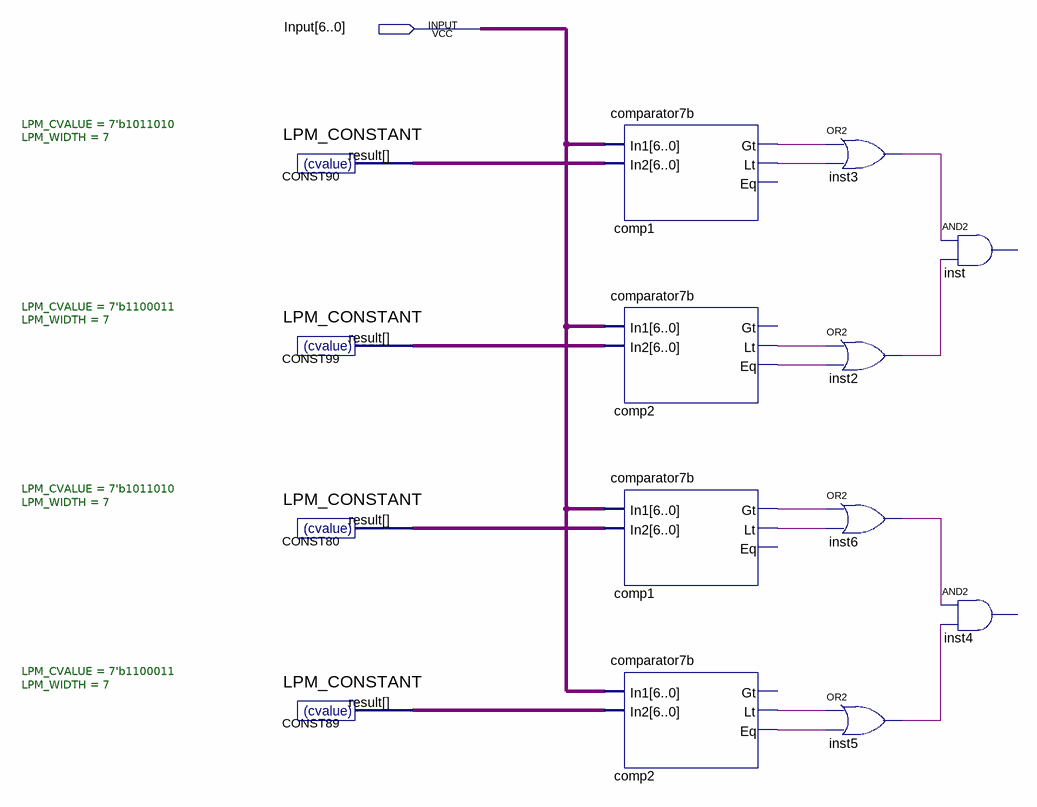
[diagram p0: schematic sheet]
// Quartus schematic letterGenerator.bdf as structural Verilog: 14 symbols, 1 pins
module letterGenerator (
  input  [6:0] Input
);

  wire comp1_gt, comp1_gt_2, comp1_lt, comp1_lt_2, comp2_eq, comp2_eq_2, comp2_lt, comp2_lt_2, inst2_out,
       inst3_out, inst5_out, inst6_out;
  wire [6:0] CONST80_result, CONST89_result, CONST90_result, CONST99_result;

  LPM_CONSTANT #(.LPM_CVALUE(7'b1011010), .LPM_WIDTH(7)) CONST90 (.result(CONST90_result));
  LPM_CONSTANT #(.LPM_CVALUE(7'b1100011), .LPM_WIDTH(7)) CONST99 (.result(CONST99_result));
  LPM_CONSTANT #(.LPM_CVALUE(7'b1011010), .LPM_WIDTH(7)) CONST80 (.result(CONST80_result));
  LPM_CONSTANT #(.LPM_CVALUE(7'b1100011), .LPM_WIDTH(7)) CONST89 (.result(CONST89_result));
  comparator7b comp1 (.In1(Input), .In2(CONST90_result), .Gt(comp1_gt), .Lt(comp1_lt));  // open: Eq
  comparator7b comp2 (.In1(Input), .In2(CONST99_result), .Lt(comp2_lt), .Eq(comp2_eq));  // open: Gt
  comparator7b comp1_dup2 (.In1(Input), .In2(CONST80_result), .Gt(comp1_gt_2), .Lt(comp1_lt_2));  // open: Eq
  comparator7b comp2_dup2 (.In1(Input), .In2(CONST89_result), .Lt(comp2_lt_2), .Eq(comp2_eq_2));  // open: Gt
  or inst3 (inst3_out, comp1_gt, comp1_lt);
  or inst2 (inst2_out, comp2_lt, comp2_eq);
  or inst6 (inst6_out, comp1_gt_2, comp1_lt_2);
  or inst5 (inst5_out, comp2_lt_2, comp2_eq_2);
  // AND2 inst has open pins: IN1=inst3_out, IN2=inst2_out, OUT=open
  // AND2 inst4 has open pins: IN1=inst6_out, IN2=inst5_out, OUT=open
endmodule
